# EAGLE design receiver (EAGLE 9.6.2)
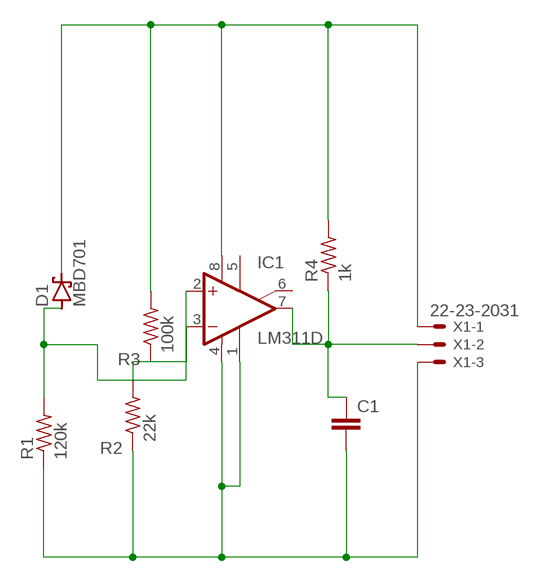
[diagram p0: schematic, sheet 1]

## Parts
C1  C2.5/2  [C2.5-2]
D1  MBD701  [TO92H]
IC1  LM311D  [SO08]
R1  120k  R-US_0207/10  [0207/10]
R2  22k  R-US_0207/10  [0207/10]
R3  100k  R-US_0207/10  [0207/10]
R4  1k  R-US_0207/10  [0207/10]
X1  22-23-2031  [22-23-2031]

## Nets
N$1: D1.2(C) IC1.8(V+) R3.2 R4.2 X1.1
N$2: C1.2 IC1.1(GND) IC1.4(V-) R1.1 R2.1 X1.3
N$3: D1.1(A) IC1.2(+IN) R1.2
N$4: IC1.3(-IN) R2.2 R3.1
N$5: C1.1 IC1.7(OUT) R4.1 X1.2
Unconnected: IC1.5(ON) IC1.6(ON/STR)

## Library data of the parts
C1 = capacitor-wima:C: CAPACITOR naming: grid - package width
D1 = diode:MBD701: UHF DIODE
IC1 = linear:LM311: COMPARATOR
R1-R4 = rcl:R-US_: RESISTOR, American symbol; SPICEPREFIX: R
X1 = con-molex:22-23-2031: .100" (2.54mm) Center Header - 3 Pin; MF: MOLEX; MPN: 22-23-2031; OC_FARNELL: 1462950; OC_NEWARK: 30C0862

## Board
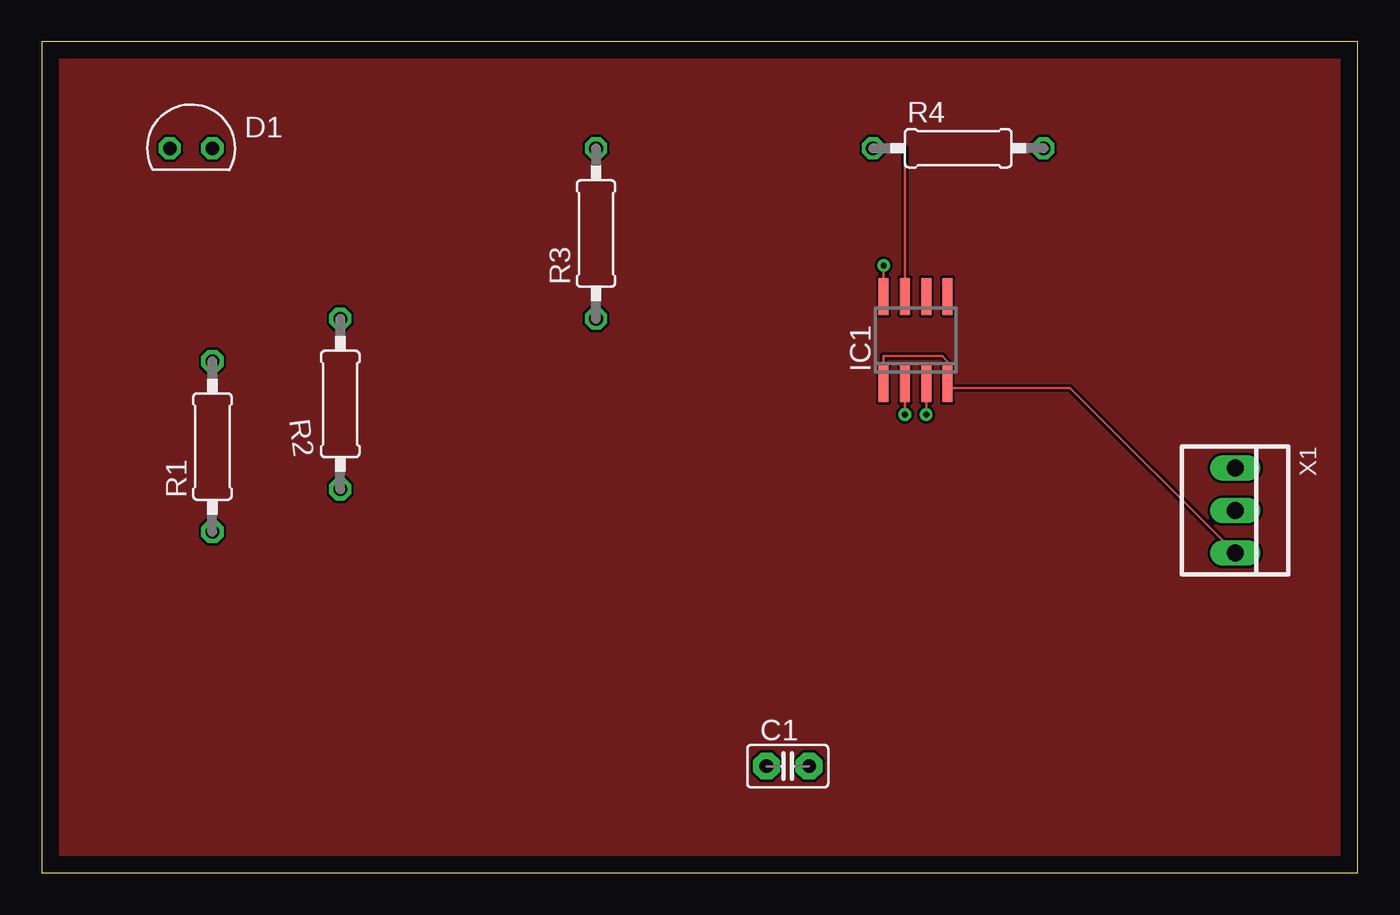
[diagram p1: board, top side]
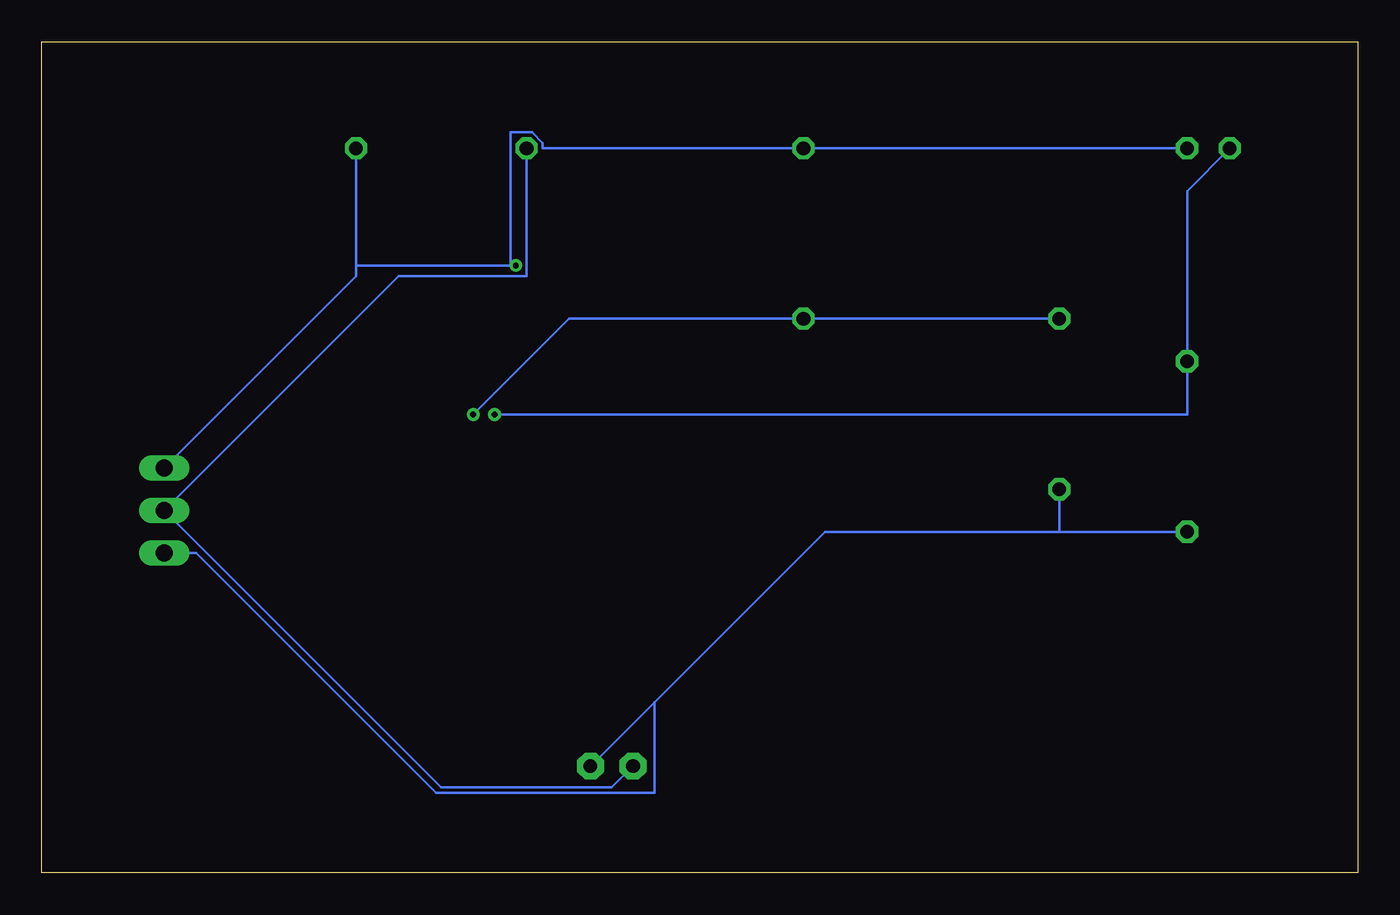
[diagram p2: board, bottom side, seen from below]

Size 78.41 x 49.52 mm. Coordinates in mm from the lower left corner, seen from the top.
Outline: 0,0 78.41,0 78.41,49.52 0,49.52 0,0
Copper layers (1*16): Top 0.035mm / dielectric 1.5mm / Bottom 0.035mm
Design rules "default": minimum track width 6mil, minimum drill 0.35mm, track to track 6mil, track to pad 6mil, pad to pad 6mil, via to via 6mil, smd to smd 6mil, copper to edge 40mil, drill to drill 6mil, minimum pad ring 10mil, minimum via ring 8mil, stop-mask expansion 4mil, vias tented up to drill 0mil, thermal gap 10mil

### Footprints (pad centres in the part's own frame; a part is rotated, then mirrored left to right if it is on the bottom)
C2.5-2 = drill 0.813 pad 1.6 octagon: 1 -1.27,0; 2 1.27,0
TO92H = drill 0.813 octagon: 1 -1.27,0; 2 1.27,0
SO08 = smd 0.6 x 2.2: 1 -1.905,-2.6; 2 -0.635,-2.6; 3 0.635,-2.6; 4 1.905,-2.6; 5 1.905,2.6; 6 0.635,2.6; 7 -0.635,2.6; 8 -1.905,2.6
0207/10 = drill 0.813 octagon: 1 -5.08,0; 2 5.08,0
22-23-2031 = drill 1 long: 1 -2.54,0; 2 0,0; 3 2.54,0

### Placement (x,y rotation side)
C1  44.45,6.35 0 top
D1  8.89,43.18 0 top
IC1  52.07,31.75 0 top
R1  10.16,25.4 90 top
R2  17.78,27.94 90 top
R3  33.02,38.1 90 top
R4  54.61,43.18 0 top
X1  71.12,21.59 270 top

### Tracks (layer width: path | path; a pad name or v marks a point on that pad's centre or on a via)
N$1  (via drill 0.35)
  Top 0.152: v50.16,36.19 IC1.8
  Bottom 0.152: D1.2 R3.2 48.58,43.18 48.58,43.5 49.21,44.13 50.48,44.13 50.48,36.19 | 59.69,36.19 50.48,36.19 | R4.2 59.69,36.19 | X1.1 59.69,35.56 59.69,36.19 | 50.48,36.19 v50.16,36.19
N$2
  Top 0.152: IC1.1 50.16,30.8 53.66,30.8 53.98,30.48 IC1.4 53.98,28.89 61.28,28.89 X1.3
  Bottom 0.152: 17.78,20.32 R1.1 | R2.1 17.78,20.32 | 41.91,10.16 31.75,20.32 17.78,20.32 | 41.91,10.16 C1.2 | X1.3 69.22,19.05 54.93,4.76 41.91,4.76 41.91,10.16
N$3  (via drill 0.35)
  Top 0.152: v51.43,27.3 IC1.2
  Bottom 0.152: v51.43,27.3 10.16,27.3 R1.2 10.16,40.64 D1.1
N$4  (via drill 0.35)
  Top 0.152: v52.7,27.3 IC1.3
  Bottom 0.152: v52.7,27.3 46.99,33.02 R3.1 R2.2
N$5
  Top 0.152: IC1.7 51.43,43.18 R4.1
  Bottom 0.152: R4.1 49.53,35.56 57.15,35.56 X1.2 54.61,5.08 44.45,5.08 C1.1
N$6
  pour Top: 78.74,49.53 78.74,0 0,0 0,49.53